# Altium schematic sheet Heating_Tape.SchDoc
size A
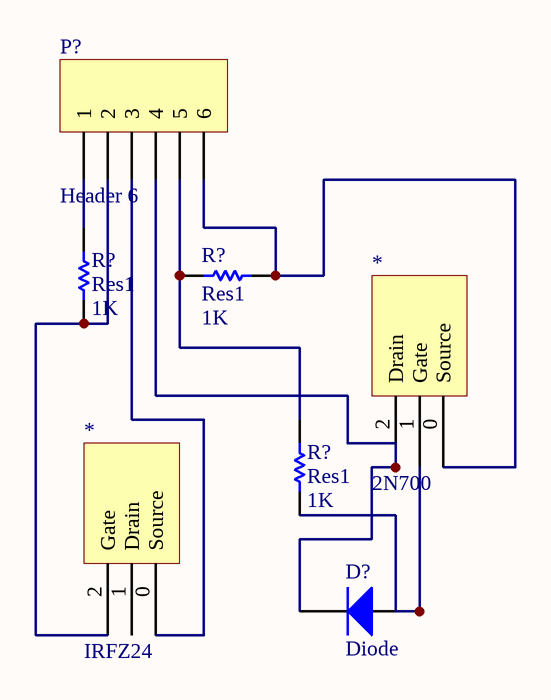
[diagram p0: Heating_Tape.SchDoc]

## Parts
(Parts that share a designator on the sheet are numbered #1, #2 ... from top to bottom, then left to right.)
*#1  2N700
*#2  IRFZ24
D?  Diode  [SMC]
P?  Header 6  [HDR1X6]
R?#1  Res1  value 1K  [AXIAL-0.3]
R?#2  Res1  value 1K  [AXIAL-0.3]
R?#3  Res1  value 1K  [AXIAL-0.3]

## Nets
Net*#1_0: *#1.0(Source) P?.6 R?#2.1
Net*#1_1: *#1.1(Gate) D?.1(A) R?#3.1
Net*#1_2: *#1.2(Drain) D?.2(K) P?.4
Net*#2_0: *#2.0(Source) P?.3
Net*#2_2: *#2.2(Gate) P?.2 R?#1.1
NetP?_1: P?.1 R?#1.2
NetP?_5: P?.5 R?#2.2 R?#3.2

Not connected (* = marked no-connect by the designer): *#2 1(Drain)

## Library data of the parts
D? = Diode: Default Diode; Published: 8-Jun-2000; LatestRevisionDate: 17-Jul-2002; LatestRevisionNote: Re-released for DXP Platform.; PackageVersion: Sep-1996; PackageReference: SMC; Publisher: Altium Limited; PackageDescription: DO-214-AB/SMC; 2 C-Bend Leads; Body 7.9 x 5.9 mm, inc. leads (LxW); Code_JEDEC: DO-214-AB
P? = Header 6: Header, 6-Pin; LatestRevisionDate: 17-Jul-2002; LatestRevisionNote: Re-released for DXP Platform.; Publisher: Altium Limited
R?#1-R?#3 = Res1: Resistor; Published: 8-Jun-2000; LatestRevisionDate: 17-Jul-2002; LatestRevisionNote: Re-released for DXP Platform.; PackageReference: AXIAL-0.3; Publisher: Altium Limited; PackageDescription: Axial Device, Thru-Hole; 2 Leads; 0.3 in Pin Spacing